# EAGLE design di_box (EAGLE 9.1.0)
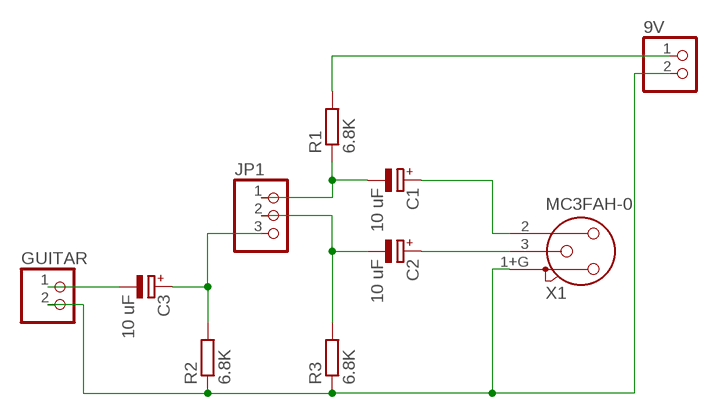
[diagram p0: schematic, sheet 1]

## Parts
9V  PINHD-1X2  [1X02]
C1  10 uF  CPOL-EUE2-4  [E2-4]
C2  10 uF  CPOL-EUE2-4  [E2-4]
C3  10 uF  CPOL-EUE2-4  [E2-4]
GUITAR  PINHD-1X2  [1X02]
JP1  PINHD-1X3  [1X03]
R1  6.8K  R-EU_0207/10  [0207/10]
R2  6.8K  R-EU_0207/10  [0207/10]
R3  6.8K  R-EU_0207/10  [0207/10]
X1  MC3FAH-0  [NC3FAH1-0]

## Nets
N$1: C3.+ JP1.3 R2.2
N$2: C1.- JP1.1 R1.1
N$3: 9V.2 GUITAR.2 R2.1 R3.1 X1.1+G
N$4: C2.- JP1.2 R3.2
N$5: C3.- GUITAR.1
N$6: 9V.1 R1.2
N$7: C2.+ X1.3
N$8: C1.+ X1.2

## Library data of the parts
9V GUITAR = pinhead:PINHD-1X2: PIN HEADER
C1-C3 = rcl:CPOL-EU: POLARIZED CAPACITOR, European symbol; SPICEPREFIX: C
JP1 = pinhead:PINHD-1X3: PIN HEADER
R1-R3 = rcl:R-EU_: RESISTOR, European symbol; SPICEPREFIX: R
X1 = con-neutrik_ag:MC3?: Neutrik Audio Connector XLR SERIES Stereo 1/4" jack Source: www.neutrik.com/; OC_FARNELL: unknown; OC_NEWARK: unknown

## Board
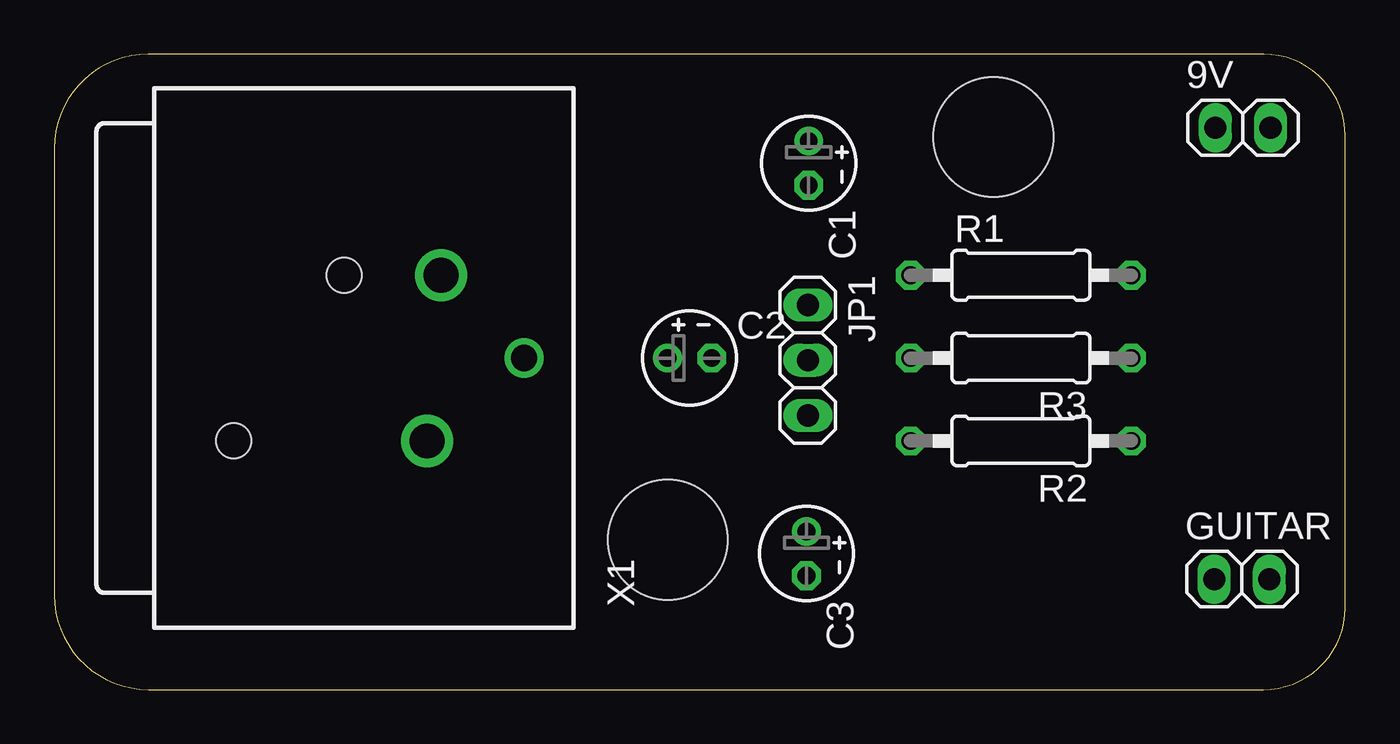
[diagram p1: board, top side]
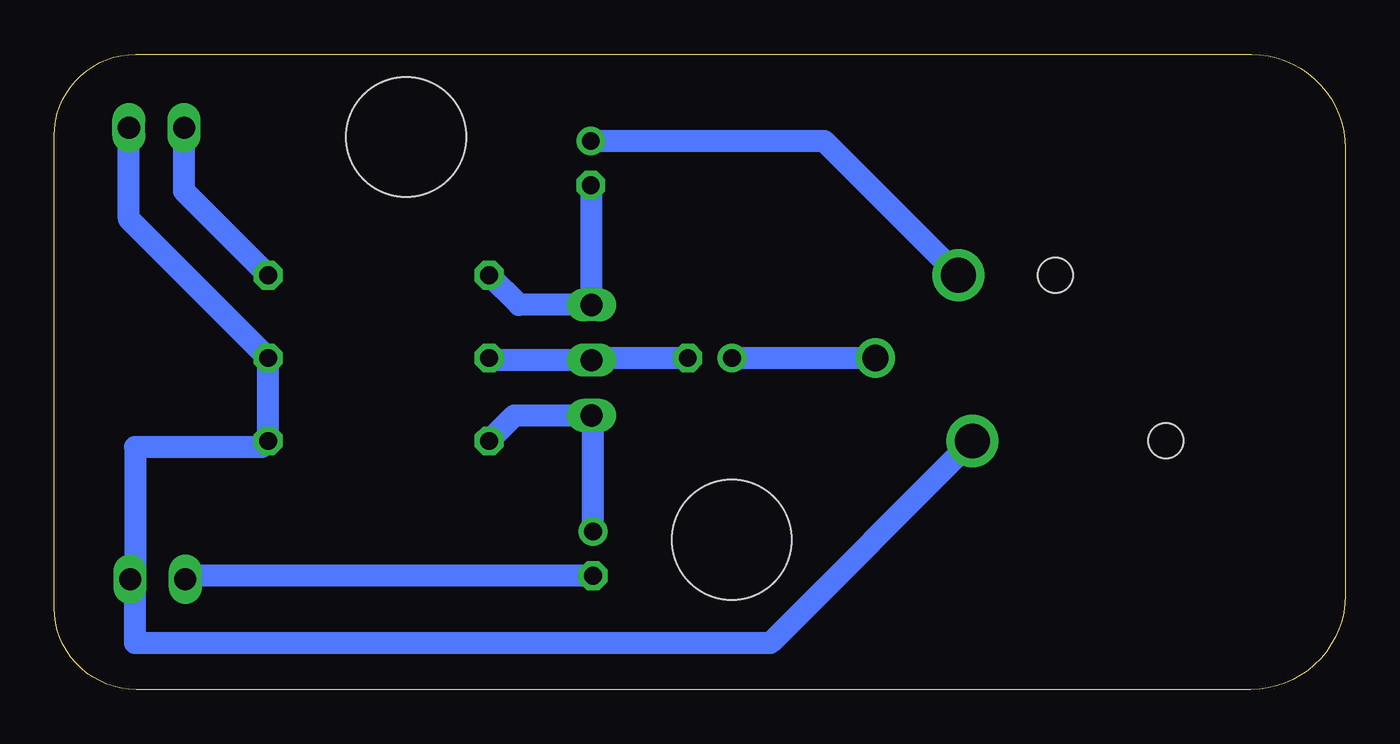
[diagram p2: board, bottom side, seen from below]

Size 59.36 x 29.2 mm. Coordinates in mm from the lower left corner, seen from the top.
Outline: 0,24.88 0,4.34 arc90 4.34,0 55.6,0 arc90 59.36,3.75 59.36,25.46 arc90 55.62,29.2 4.32,29.2 arc90 0,24.88
Copper layers (1*16): Top 0.035mm / dielectric 1.5mm / Bottom 0.035mm
Design rules "OthermillDRC_30_deg_v2": minimum track width 6mil, minimum drill 0.8mm, track to track 6mil, track to pad 6mil, pad to pad 6mil, via to via 6mil, smd to smd 0mil, copper to edge 0mil, drill to drill 6mil, minimum pad ring 10mil, minimum via ring 10mil, stop-mask expansion 1mil, vias tented up to drill 30mil, thermal gap 6mil
Holes 5.5 mm at 28.21,6.89 43.18,25.4

### Footprints (pad centres in the part's own frame; a part is rotated, then mirrored left to right if it is on the bottom)
1X02 = drill 1.016 long: 1 -1.27,0; 2 1.27,0
E2-4 = drill 0.813 pad 1.27: + -1.016,0 | drill 0.813 pad 1.27 octagon: - 1.016,0
1X03 = drill 1.016 long: 1 -2.54,0; 2 0,0; 3 2.54,0
0207/10 = drill 0.813 octagon: 1 -5.08,0; 2 5.08,0
NC3FAH1-0 = drill 1.6: 1+G -3.81,0.635; 2 3.81,0 | drill 1.2: 3 0,-3.815 | hole 1.6: -3.81,9.525; 3.81,4.445

### Placement (x,y rotation side)
9V  54.66,25.83 0 top
C1  34.69,24.2 270 top
C2  29.21,15.24 0 top
C3  34.59,6.25 270 top
GUITAR  54.61,5.08 0 top
JP1  34.65,15.14 270 top
R1  44.45,19.05 0 top
R2  44.45,11.43 180 top
R3  44.45,15.24 180 top
X1  17.78,15.24 90 top

### Tracks (layer width: path | path; a pad name or v marks a point on that pad's centre or on a via)
N$1
  Bottom 1: R2.2 38.2,12.6 JP1.3 34.59,12.54 C3.+
N$2
  Bottom 1: 34.69,22.93 C1.- 34.69,17.72 JP1.1 38,17.68 R1.1
N$3
  Bottom 1: X1.1+G 26.43,2.14 55.65,2.14 55.65,4.85 | 55.65,4.85 GUITAR.2 55.65,5.31 | 55.65,4.85 55.65,11.14 49.82,11.14 R2.1 R3.1 55.93,21.64 9V.2
N$4
  Bottom 1: C2.- 34.55,15.24 JP1.2 39.27,15.14 R3.2
N$5
  Bottom 1: GUITAR.1 53.09,5.33 52.99,5.23 C3.-
N$6
  Bottom 1: R1.2 53.39,22.91 9V.1
N$7
  Bottom 1: X1.3 C2.+
N$8
  Bottom 1: X1.2 23.95,25.22 C1.+